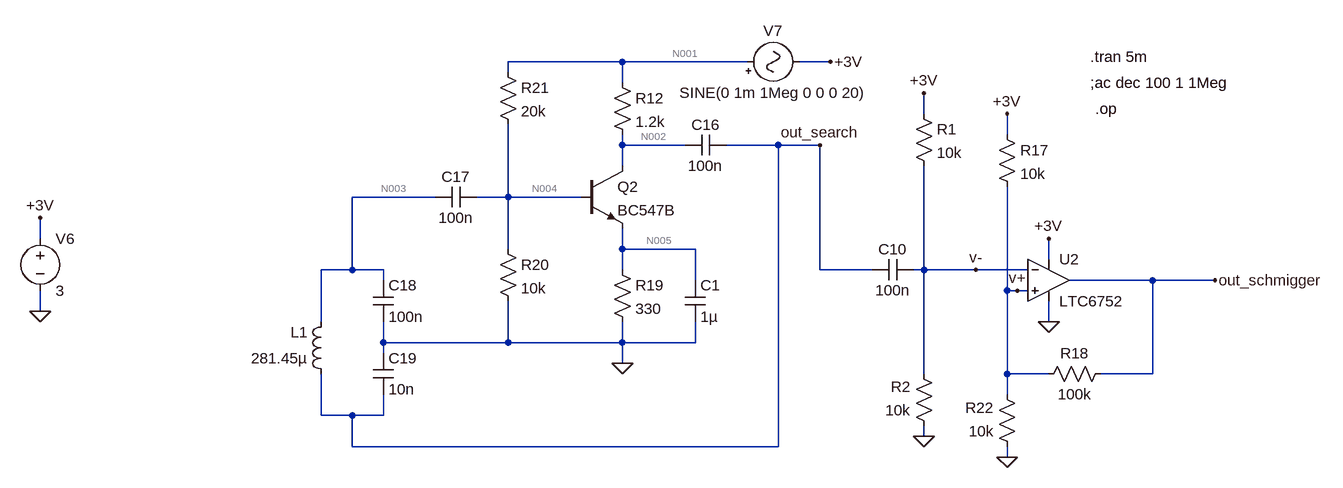
[diagram p0: schematic metal_detector_sim.asc]
metal_detector_sim.asc, the LTspice schematic file:
Version 4
SHEET 1 3100 2212
WIRE 928 1280 752 1280
WIRE 1120 1280 928 1280
WIRE 1248 1280 1200 1280
WIRE 752 1296 752 1280
WIRE 928 1312 928 1280
WIRE 1392 1360 1392 1328
WIRE 1520 1392 1520 1360
WIRE 928 1408 928 1392
WIRE 1024 1408 928 1408
WIRE 1168 1408 1088 1408
WIRE 1232 1408 1168 1408
WIRE 928 1440 928 1408
WIRE 640 1488 512 1488
WIRE 752 1488 752 1376
WIRE 752 1488 704 1488
WIRE 864 1488 752 1488
WIRE 32 1552 32 1520
WIRE 752 1568 752 1488
WIRE 928 1568 928 1536
WIRE 1040 1568 928 1568
WIRE 1584 1584 1584 1552
WIRE 512 1600 512 1488
WIRE 512 1600 464 1600
WIRE 560 1600 512 1600
WIRE 928 1600 928 1568
WIRE 1232 1600 1232 1408
WIRE 1312 1600 1232 1600
WIRE 1392 1600 1392 1440
WIRE 1392 1600 1376 1600
WIRE 1472 1600 1392 1600
WIRE 1552 1600 1472 1600
WIRE 560 1616 560 1600
WIRE 1040 1616 1040 1568
WIRE 1744 1616 1616 1616
WIRE 1840 1616 1744 1616
WIRE 1520 1632 1520 1472
WIRE 1536 1632 1520 1632
WIRE 1552 1632 1536 1632
WIRE 32 1664 32 1632
WIRE 464 1680 464 1600
WIRE 1584 1680 1584 1648
WIRE 560 1712 560 1680
WIRE 752 1712 752 1648
WIRE 752 1712 560 1712
WIRE 928 1712 928 1680
WIRE 928 1712 752 1712
WIRE 1040 1712 1040 1680
WIRE 1040 1712 928 1712
WIRE 560 1728 560 1712
WIRE 928 1744 928 1712
WIRE 1392 1760 1392 1600
WIRE 1520 1760 1520 1632
WIRE 1584 1760 1520 1760
WIRE 1744 1760 1744 1616
WIRE 1744 1760 1664 1760
WIRE 1520 1792 1520 1760
WIRE 464 1824 464 1760
WIRE 512 1824 464 1824
WIRE 560 1824 560 1792
WIRE 560 1824 512 1824
WIRE 1392 1856 1392 1840
WIRE 512 1872 512 1824
WIRE 1168 1872 1168 1408
WIRE 1168 1872 512 1872
WIRE 1520 1888 1520 1872
FLAG 32 1664 0
FLAG 32 1520 +3V
FLAG 928 1744 0
FLAG 1232 1408 out_search
FLAG 1248 1280 +3V
FLAG 1840 1616 out_schmigger
FLAG 1584 1552 +3V
FLAG 1584 1680 0
FLAG 1520 1888 0
FLAG 1520 1360 +3V
FLAG 1472 1600 v-
FLAG 1536 1632 v+
FLAG 1392 1856 0
FLAG 1392 1328 +3V
DATAFLAG 768 1280 ""
DATAFLAG 816 1488 ""
DATAFLAG 928 1568 ""
SYMBOL npn 864 1440 R0
SYMATTR InstName Q2
SYMATTR Value BC547B
SYMBOL res 912 1584 R0
SYMATTR InstName R19
SYMATTR Value 330
SYMBOL res 736 1552 R0
SYMATTR InstName R20
SYMATTR Value 10k
SYMBOL res 736 1280 R0
SYMATTR InstName R21
SYMATTR Value 20k
SYMBOL voltage 32 1536 R0
WINDOW 123 0 0 Left 0
WINDOW 39 0 0 Left 0
SYMATTR InstName V6
SYMATTR Value 3
SYMBOL cap 1088 1392 R90
WINDOW 0 0 32 VBottom 2
WINDOW 3 32 32 VTop 2
SYMATTR InstName C16
SYMATTR Value 100n
SYMBOL cap 704 1472 R90
WINDOW 0 0 32 VBottom 2
WINDOW 3 32 32 VTop 2
SYMATTR InstName C17
SYMATTR Value 100n
SYMBOL ind 480 1776 R180
WINDOW 0 36 80 Left 2
WINDOW 3 36 40 Left 2
SYMATTR InstName L1
SYMATTR Value 281.45µ
SYMBOL cap 544 1616 R0
SYMATTR InstName C18
SYMATTR Value 100n
SYMBOL cap 544 1728 R0
SYMATTR InstName C19
SYMATTR Value 10n
SYMBOL Misc\\signal 1104 1280 R270
WINDOW 0 32 56 VTop 2
WINDOW 3 -32 56 VBottom 2
WINDOW 123 -56 56 VBottom 2
WINDOW 39 0 0 Left 0
SYMATTR InstName V7
SYMATTR Value SINE(0 1m 1Meg 0 0 0 20)
SYMBOL res 912 1296 R0
SYMATTR InstName R12
SYMATTR Value 1.2k
SYMBOL cap 1024 1616 R0
SYMATTR InstName C1
SYMATTR Value 1µ
SYMBOL res 1504 1376 R0
SYMATTR InstName R17
SYMATTR Value 10k
SYMBOL res 1680 1744 R90
WINDOW 0 0 56 VBottom 2
WINDOW 3 32 56 VTop 2
SYMATTR InstName R18
SYMATTR Value 100k
SYMBOL res 1536 1888 R180
WINDOW 0 36 76 Left 2
WINDOW 3 36 40 Left 2
SYMATTR InstName R22
SYMATTR Value 10k
SYMBOL Comparators\\LTC6752 1584 1552 R0
SYMATTR InstName U2
SYMBOL cap 1376 1584 R90
WINDOW 0 0 32 VBottom 2
WINDOW 3 32 32 VTop 2
SYMATTR InstName C10
SYMATTR Value 100n
SYMBOL res 1376 1344 R0
SYMATTR InstName R1
SYMATTR Value 10k
SYMBOL res 1408 1856 R180
WINDOW 0 36 76 Left 2
WINDOW 3 36 40 Left 2
SYMATTR InstName R2
SYMATTR Value 10k
TEXT 1648 1272 Left 2 !.tran 5m
TEXT 1648 1312 Left 2 !;ac dec 100 1 1Meg
TEXT 1656 1352 Left 2 !.op

The netlist it stands for:
* metal_detector_sim.asc
Q2 N002 N004 N005 0 BC547B
R19 N005 0 330
R20 N004 0 10k
R21 N001 N004 20k
V6 +3V 0 3
C16 out_search N002 100n
C17 N004 N003 100n
L1 out_search N003 281.45µ
C18 N003 0 100n
C19 0 out_search 10n
V7 N001 +3V SINE(0 1m 1Meg 0 0 0 20)
R12 N001 N002 1.2k
C1 N005 0 1µ
R17 +3V v+ 10k
R18 out_schmigger v+ 100k
R22 0 v+ 10k
XU2 v+ v- +3V 0 out_schmigger LTC6752  ; pins In+ In- V+ V- OUT
C10 v- out_search 100n
R1 +3V v- 10k
R2 0 v- 10k
.model NPN NPN
.model PNP PNP
.lib standard.bjt
.tran 5m
;ac dec 100 1 1Meg
.op
.lib LTC7.lib
.backanno
.end

* Results of the author's LTspice run, read from the files saved beside the schematic
* Operating Point, zero values left out:
*   V(n002) = 1.778 V
*   V(n004) = 976.3 mV
*   V(n005) = 337.2 mV
*   V(n001) = 3 V
*   V(+3v) = 3 V
*   V(out_search) = 468 nV
*   V(n003) = 468 nV
*   V(v+) = 1.438 V
*   V(out_schmigger) = 279.3 µV
*   V(v-) = 1.502 V
*   Ic(Q2) = 1.018 mA
*   Ib(Q2) = 3.56 µA
*   Ie(Q2) = -1.022 mA
*   I(R2) = -150.2 µA
*   I(R1) = 149.8 µA
*   I(R22) = -143.8 µA
*   I(R18) = -14.38 µA
*   I(R17) = 156.2 µA
*   I(R12) = 1.018 mA
*   I(R21) = 101.2 µA
*   I(R20) = 97.63 µA
*   I(R19) = 1.022 mA
*   I(V7) = -1.119 mA
*   I(V6) = -6.125 mA
*   Ix(u2:1) = -1.966 µA
*   Ix(u2:2) = -426.1 nA
*   Ix(u2:3) = 4.7 mA
*   Ix(u2:4) = -4.712 mA
*   Ix(u2:5) = 14.38 µA